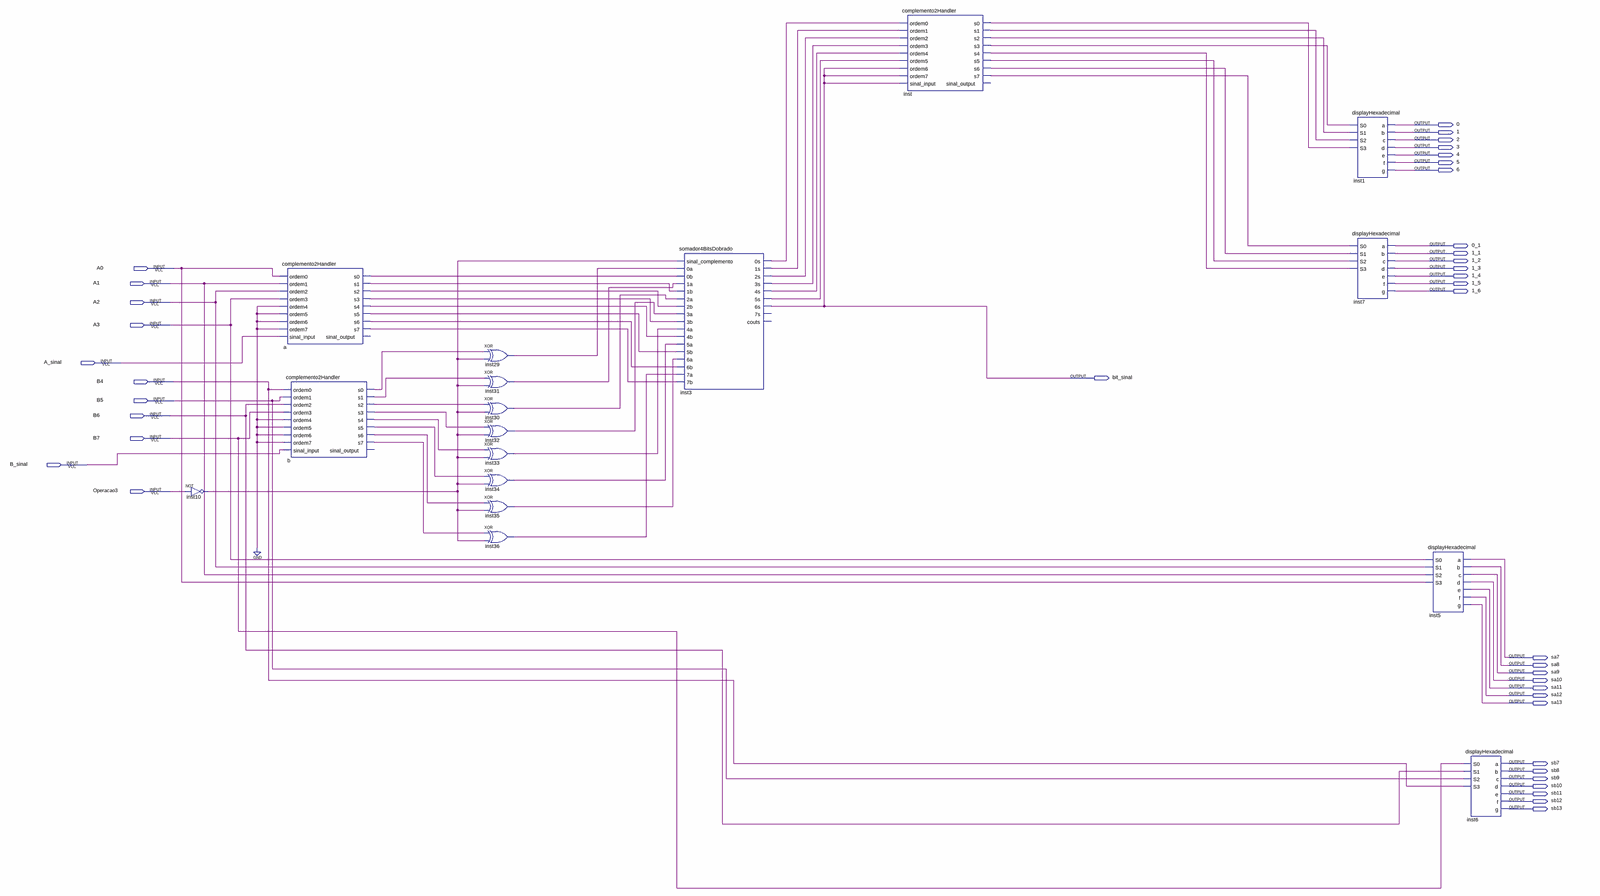
[diagram p0: schematic sheet, whole]
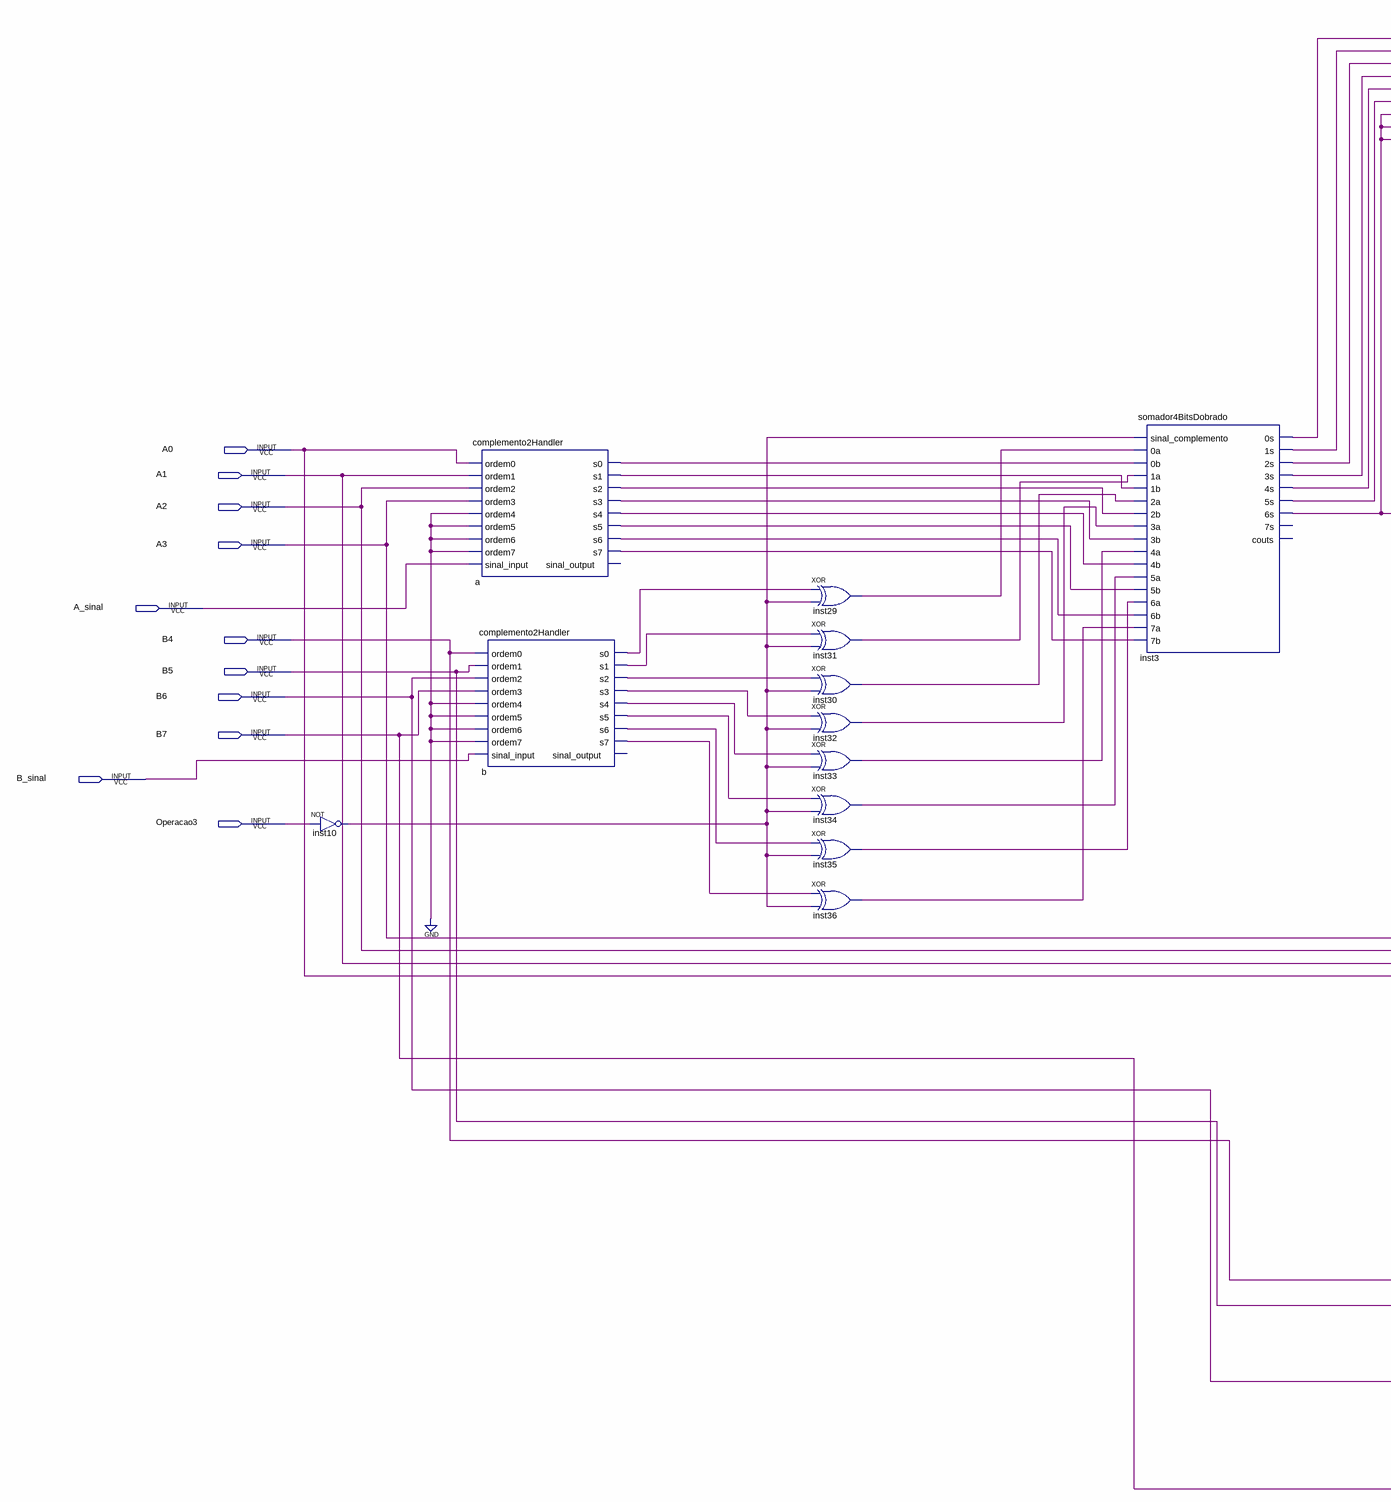
[diagram p1: schematic sheet, left part]
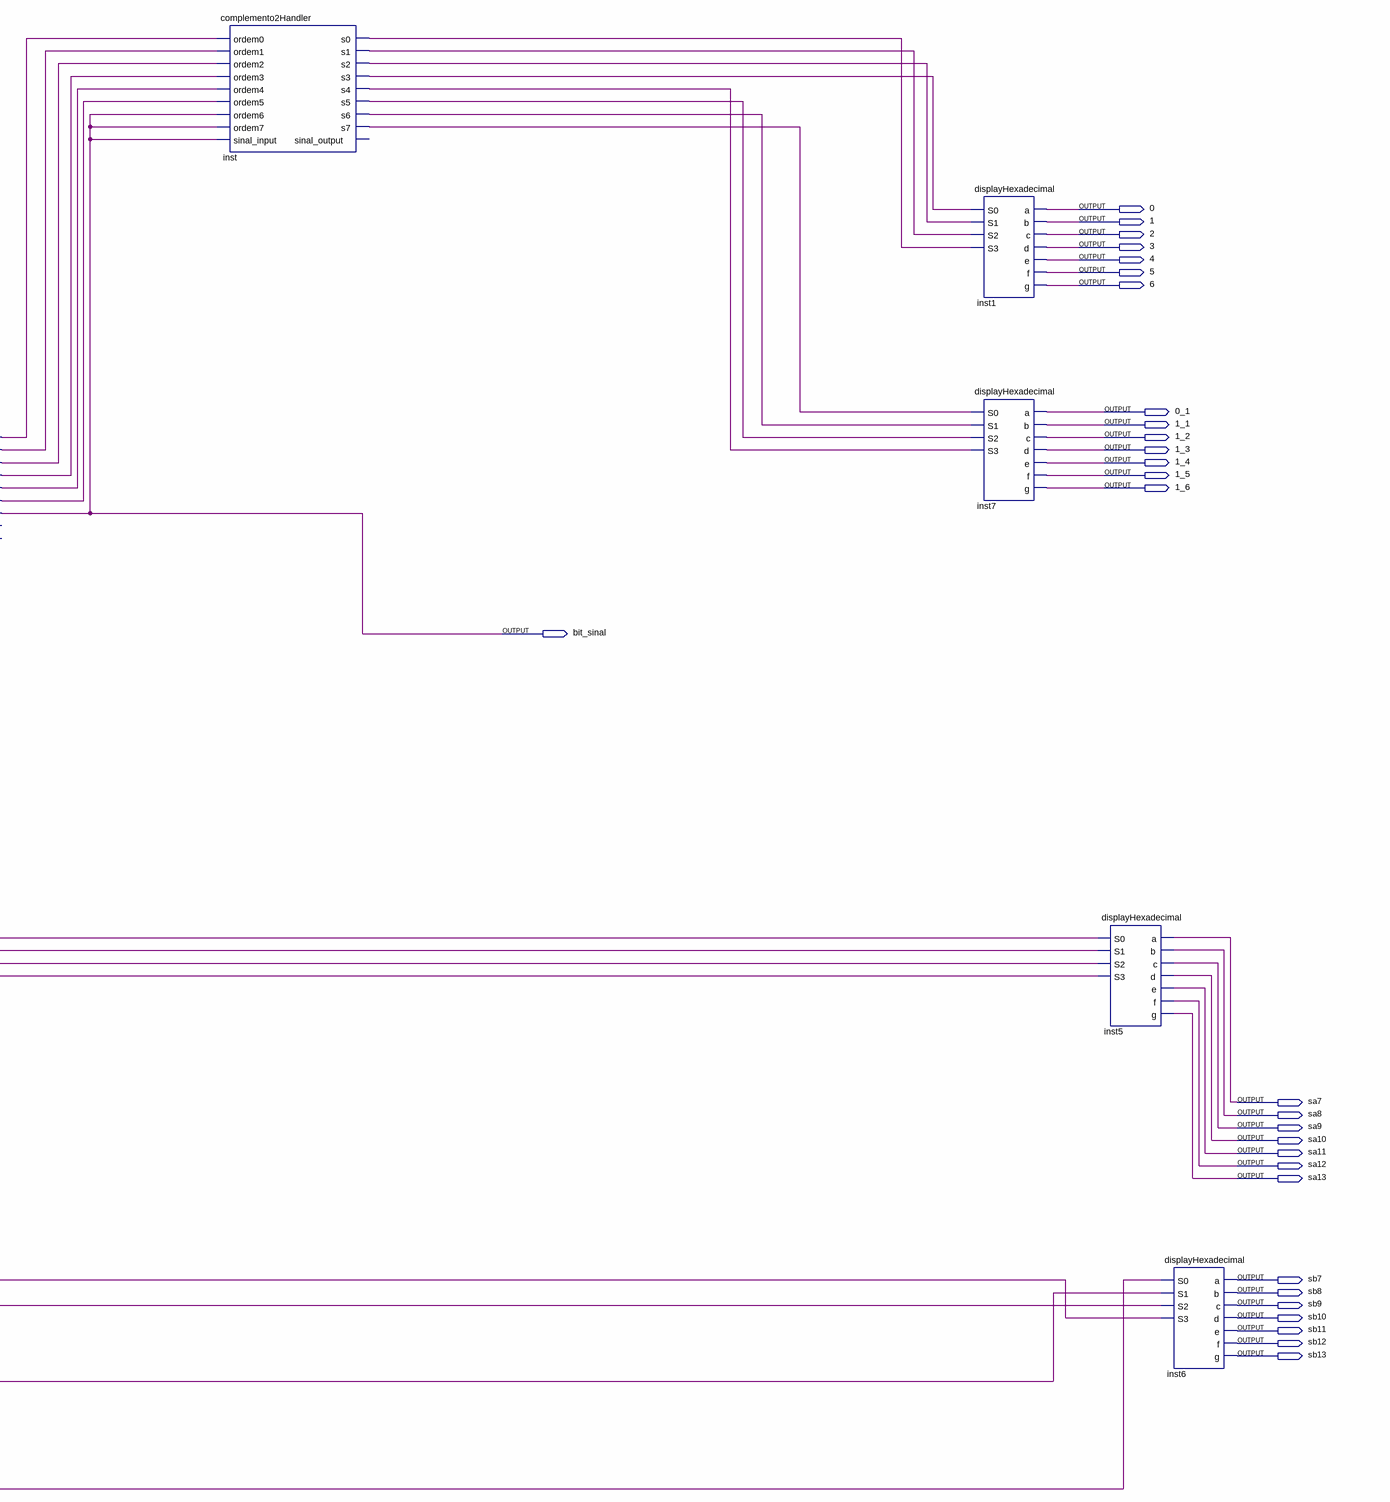
[diagram p2: schematic sheet, right part]
// Quartus schematic aula09.bdf as structural Verilog: 17 symbols, 40 pins
module aula09 (
  input  A0,
  input  A1,
  input  A2,
  input  A3,
  input  A_sinal,
  input  B4,
  input  B5,
  input  B6,
  input  B7,
  input  B_sinal,
  input  Operacao3,
  output \0 ,
  output \1 ,
  output \2 ,
  output \3 ,
  output \4 ,
  output \5 ,
  output \6 ,
  output \0_1 ,
  output \1_1 ,
  output \1_2 ,
  output \1_3 ,
  output \1_4 ,
  output \1_5 ,
  output \1_6 ,
  output bit_sinal,
  output sa7,
  output sa8,
  output sa9,
  output sa10,
  output sa11,
  output sa12,
  output sa13,
  output sb7,
  output sb8,
  output sb9,
  output sb10,
  output sb11,
  output sb12,
  output sb13
);

  wire a_s0, a_s1, a_s2, a_s3, a_s4, a_s5, a_s6, a_s7, b_s0, b_s1, b_s2, b_s3, b_s4, b_s5, b_s6, b_s7,
       inst3_0s, inst3_1s, inst3_2s, inst3_3s, inst3_4s, inst3_5s, inst10_out, inst29_out, inst30_out,
       inst31_out, inst32_out, inst33_out, inst34_out, inst35_out, inst36_out, inst_s0, inst_s1, inst_s2,
       inst_s3, inst_s4, inst_s5, inst_s6, inst_s7;

  not inst10 (inst10_out, Operacao3);
  complemento2Handler a (
    .ordem0(A0), .ordem1(A1), .ordem2(A2), .ordem3(A3), .ordem4(1'b0), .ordem5(1'b0), .ordem6(1'b0),
    .ordem7(1'b0), .sinal_input(A_sinal), .s0(a_s0), .s1(a_s1), .s2(a_s2), .s3(a_s3), .s4(a_s4), .s5(a_s5),
    .s6(a_s6), .s7(a_s7));  // open: sinal_output
  complemento2Handler b (
    .ordem0(B4), .ordem1(B5), .ordem2(B6), .ordem3(B7), .ordem4(1'b0), .ordem5(1'b0), .ordem6(1'b0),
    .ordem7(1'b0), .sinal_input(B_sinal), .s0(b_s0), .s1(b_s1), .s2(b_s2), .s3(b_s3), .s4(b_s4), .s5(b_s5),
    .s6(b_s6), .s7(b_s7));  // open: sinal_output
  xor inst29 (inst29_out, b_s0, inst10_out);
  xor inst31 (inst31_out, b_s1, inst10_out);
  xor inst30 (inst30_out, b_s2, inst10_out);
  xor inst32 (inst32_out, b_s3, inst10_out);
  xor inst33 (inst33_out, b_s4, inst10_out);
  xor inst34 (inst34_out, b_s5, inst10_out);
  xor inst35 (inst35_out, b_s6, inst10_out);
  xor inst36 (inst36_out, b_s7, inst10_out);
  somador4BitsDobrado inst3 (
    .sinal_complemento(inst10_out), .\0a (inst29_out), .\0b (a_s0), .\1a (inst31_out), .\1b (a_s1),
    .\2a (inst30_out), .\2b (a_s2), .\3a (inst32_out), .\3b (a_s3), .\4a (inst33_out), .\4b (a_s4),
    .\5a (inst34_out), .\5b (a_s5), .\6a (inst35_out), .\6b (a_s6), .\7a (inst36_out), .\7b (a_s7),
    .\0s (inst3_0s), .\1s (inst3_1s), .\2s (inst3_2s), .\3s (inst3_3s), .\4s (inst3_4s), .\5s (inst3_5s),
    .\6s (bit_sinal));  // open: 7s, couts
  complemento2Handler inst (
    .ordem0(inst3_0s), .ordem1(inst3_1s), .ordem2(inst3_2s), .ordem3(inst3_3s), .ordem4(inst3_4s),
    .ordem5(inst3_5s), .ordem6(bit_sinal), .ordem7(bit_sinal), .sinal_input(bit_sinal), .s0(inst_s0),
    .s1(inst_s1), .s2(inst_s2), .s3(inst_s3), .s4(inst_s4), .s5(inst_s5), .s6(inst_s6), .s7(inst_s7));  // open: sinal_output
  displayHexadecimal inst1 (
    .S0(inst_s3), .S1(inst_s2), .S2(inst_s1), .S3(inst_s0), .a(\0 ), .b(\1 ), .c(\2 ), .d(\3 ), .e(\4 ),
    .f(\5 ), .g(\6 ));
  displayHexadecimal inst7 (
    .S0(inst_s7), .S1(inst_s6), .S2(inst_s5), .S3(inst_s4), .a(\0_1 ), .b(\1_1 ), .c(\1_2 ), .d(\1_3 ),
    .e(\1_4 ), .f(\1_5 ), .g(\1_6 ));
  displayHexadecimal inst5 (
    .S0(A3), .S1(A2), .S2(A1), .S3(A0), .a(sa7), .b(sa8), .c(sa9), .d(sa10), .e(sa11), .f(sa12), .g(sa13));
  displayHexadecimal inst6 (
    .S0(B7), .S1(B6), .S2(B5), .S3(B4), .a(sb7), .b(sb8), .c(sb9), .d(sb10), .e(sb11), .f(sb12), .g(sb13));
endmodule
